# Altium project CM5 Nas.PrjPcb (part 2 of 2)

## Sheet Sata_Drives.SchDoc
size 309 x 209 mm
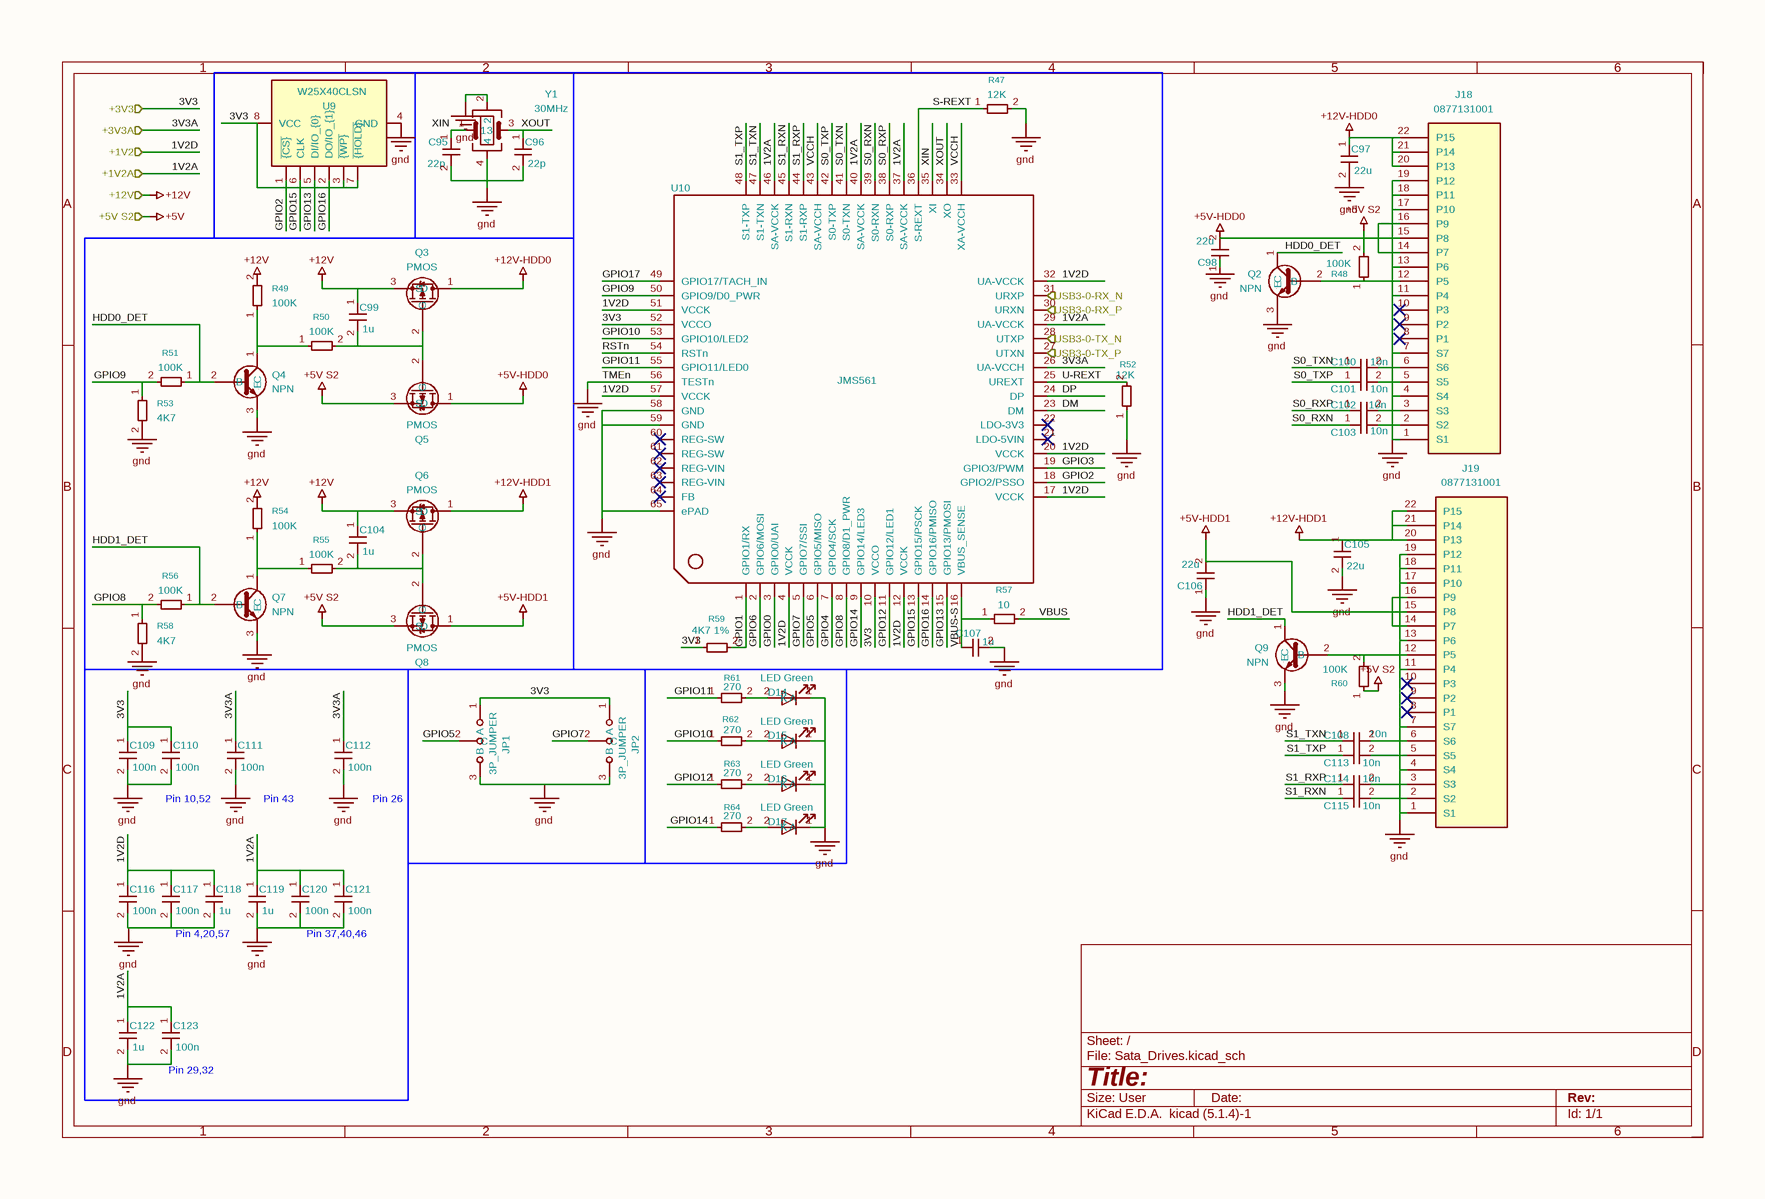
[diagram p11: Sata_Drives.SchDoc]

### Parts
C95  22p  [C_0402_1005Metric]
C96  22p  [C_0402_1005Metric]
C97  22u  [C_1206_3216Metric]
C98  22u  [C_1206_3216Metric]
C99  1u  [C_0805_2012Metric]
C100  10n  [C_0402_1005Metric]
C101  10n  [C_0402_1005Metric]
C102  10n  [C_0402_1005Metric]
C103  10n  [C_0402_1005Metric]
C104  1u  [C_0805_2012Metric]
C105  22u  [C_1206_3216Metric]
C106  22u  [C_1206_3216Metric]
C107  1u  [C_0603_1608Metric]
C108  10n  [C_0402_1005Metric]
C109  100n  [C_0402_1005Metric]
C110  100n  [C_0402_1005Metric]
C111  100n  [C_0402_1005Metric]
C112  100n  [C_0402_1005Metric]
C113  10n  [C_0402_1005Metric]
C114  10n  [C_0402_1005Metric]
C115  10n  [C_0402_1005Metric]
C116  100n  [C_0402_1005Metric]
C117  100n  [C_0402_1005Metric]
C118  1u  [C_0402_1005Metric]
C119  1u  [C_0402_1005Metric]
C120  100n  [C_0402_1005Metric]
C121  100n  [C_0402_1005Metric]
C122  1u  [C_0402_1005Metric]
C123  100n  [C_0402_1005Metric]
D14  LED Green  [LED_0603_1608Metric]
D15  LED Green  [LED_0603_1608Metric]
D16  LED Green  [LED_0603_1608Metric]
D17  LED Green  [LED_0603_1608Metric]
J18  0877131001  [87713-1001]
J19  0877131001  [87713-1001]
JP1  3P_JUMPER  [PinHeader_1x03_P2.54mm_Vertical]
JP2  3P_JUMPER  [PinHeader_1x03_P2.54mm_Vertical]
Q2  NPN  [P200_SOT-23]
Q3  PMOS  [SOT95P237X117-3N]
Q4  NPN  [P200_SOT-23]
Q5  PMOS  [SOT95P237X117-3N]
Q6  PMOS  [SOT95P237X117-3N]
Q7  NPN  [P200_SOT-23]
Q8  PMOS  [SOT95P237X117-3N]
Q9  NPN  [P200_SOT-23]
R47  12K  [R_0603_1608Metric]
R48  100K  [R_0603_1608Metric]
R49  100K  [R_0603_1608Metric]
R50  100K  [R_0603_1608Metric]
R51  100K  [R_0603_1608Metric]
R52  12K  [R_0603_1608Metric]
R53  4K7  [R_0603_1608Metric]
R54  100K  [R_0603_1608Metric]
R55  100K  [R_0603_1608Metric]
R56  100K  [R_0603_1608Metric]
R57  10  [R_0603_1608Metric]
R58  4K7  [R_0603_1608Metric]
R59  4K7 1%  [R_0603_1608Metric]
R60  100K  [R_0603_1608Metric]
R61  270  [R_0603_1608Metric]
R62  270  [R_0603_1608Metric]
R63  270  [R_0603_1608Metric]
R64  270  [R_0603_1608Metric]
U9  W25X40CLSN  [SOIC-8_3.9x4.9mm_P1.27mm]
U10  JMS561  [QFN-64-1EP_8x8mm_P0.4mm_EP6.5x6.5mm_ThermalVias]
Y1  30MHz  [ABM810000MHZ12D2W]

### Ports
+1V2 (in), +1V2A (in), +3V3 (in), +3V3A (in), +5V S2 (in), +12V (in), USB3-0-RX_N (in), USB3-0-RX_P (in), USB3-0-TX_N (out), USB3-0-TX_P (out)

### Nets
1V2D: C116.1 C117.1 C118.1 U10.4(VCCK) U10.12(VCCK) U10.17(VCCK) U10.20(VCCK) U10.32(UA-VCCK) U10.51(VCCK) U10.57(VCCK) ; port +1V2  [project net +1V2]
3V3A: C111.1 C112.1 U10.26(UA-VCCH) ; port +3V3A  [project net +3V3A]
+5V S2: Q5.3(S) Q8.3(S) R48.2 R60.1 ; port +5V S2  [also labelled +5V]
+5V-HDD0: C98.2 J18.14(P7) J18.15(P8) J18.16(P9) Q5.1(D)
+5V-HDD1: C106.2 J19.14(P7) J19.15(P8) J19.16(P9) Q8.1(D)
+12V: C99.1 C104.1 Q3.3(S) Q6.3(S) R49.2 R54.2 ; port +12V
+12V-HDD0: C97.1 J18.20(P13) J18.21(P14) J18.22(P15) Q3.1(D)
+12V-HDD1: C105.1 J19.20(P13) J19.21(P14) J19.22(P15) Q6.1(D)
GND: C95.2 C96.2 C97.2 C98.1 C105.2 C106.1 C107.2 C109.2 C110.2 C111.2 C112.2 C116.2 C117.2 C118.2 C119.2 C120.2 C121.2 C122.2 C123.2 D14.1(K) D15.1(K) D16.1(K) D17.1(K) J18.1(S1) J18.4(S4) J18.7(S7) J18.11(P4) J18.13(P6) J18.17(P10) J18.18(P11) J18.19(P12) J19.1(S1) J19.4(S4) J19.7(S7) J19.11(P4) J19.13(P6) J19.17(P10) J19.18(P11) J19.19(P12) JP1.3(B) JP2.3(B) Q2.3(E) Q4.3(E) Q7.3(E) Q9.3(E) R47.2 R52.1 R53.2 R58.2 U9.4(GND) U10.56(TESTn) U10.58(GND) U10.59(GND) U10.65(ePAD) Y1.2 Y1.4  [also labelled TMEn]
1V2A: C119.1 C120.1 C121.1 C122.1 C123.1 U10.29(UA-VCCK) U10.37(SA-VCCK) U10.40(SA-VCCK) U10.46(SA-VCCK) ; port +1V2A  [project net +1V2A]
3V3: C109.1 C110.1 JP1.1(A) JP2.1(A) R59.1 U9.3(~{{WP}}) U9.7(~{{HOLD}}) U9.8(VCC) U10.10(VCCO) U10.52(VCCO) ; port +3V3  [project net +3V3]
DM: U10.23(DM)
DP: U10.24(DP)
GPIO0: U10.3(GPIO0/UAI)
GPIO1: R59.2 U10.1(GPIO1/RX)
GPIO2: U9.1(~{{CS}}) U10.18(GPIO2/PSSO)
GPIO3: U10.19(GPIO3/PWM)
GPIO4: U10.7(GPIO4/SCK)
GPIO5: JP1.2(C) U10.6(GPIO5/MISO)
GPIO6: U10.2(GPIO6/MOSI)
GPIO7: JP2.2(C) U10.5(GPIO7/SSI)
GPIO8: R56.2 R58.1 U10.8(GPIO8/D1_PWR)
GPIO9: R51.2 R53.1 U10.50(GPIO9/D0_PWR)
GPIO10: R62.1 U10.53(GPIO10/LED2)
GPIO11: R61.1 U10.55(GPIO11/LED0)
GPIO12: R63.1 U10.11(GPIO12/LED1)
GPIO13: U9.5(DI/IO_{0}) U10.15(GPIO13/PMOSI)
GPIO14: R64.1 U10.9(GPIO14/LED3)
GPIO15: U9.6(CLK) U10.13(GPIO15/PSCK)
GPIO16: U9.2(DO/IO_{1}) U10.14(GPIO16/PMISO)
GPIO17: U10.49(GPIO17/TACH_IN)
HDD0_DET: Q2.1(C) Q4.2(B) R51.1
HDD1_DET: Q7.2(B) Q9.1(C) R56.1
RSTn: U10.54(RSTn)
S0_RXN: C103.1 U10.39(S0-RXN)
S0_RXP: C102.1 U10.38(S0-RXP)
S0_TXN: C100.1 U10.41(S0-TXN)
S0_TXP: C101.1 U10.42(S0-TXP)
S1_RXN: C115.1 U10.45(S1-RXN)
S1_RXP: C114.1 U10.44(S1-RXP)
S1_TXN: C108.1 U10.47(S1-TXN)
S1_TXP: C113.1 U10.48(S1-TXP)
S-REXT: R47.1 U10.36(S-REXT)
U-REXT: R52.2 U10.25(UREXT)
USB3-0-RX_N: U10.31(URXP) ; port USB3-0-RX_N
USB3-0-RX_P: U10.30(URXN) ; port USB3-0-RX_P
USB3-0-TX_N: U10.28(UTXP) ; port USB3-0-TX_N
USB3-0-TX_P: U10.27(UTXN) ; port USB3-0-TX_P
VBUS: R57.2
VBUS-S: C107.1 R57.1 U10.16(VBUS_SENSE)
VCCH: U10.33(XA-VCCH) U10.43(SA-VCCH)
XIN: C95.1 U10.35(XI) Y1.1
XOUT: C96.1 U10.34(XO) Y1.3
NetC99_2: C99.2 Q3.2(G) Q5.2(G) R50.2
NetC100_2: C100.2 J18.6(S6)
NetC101_2: C101.2 J18.5(S5)
NetC102_2: C102.2 J18.3(S3)
NetC103_2: C103.2 J18.2(S2)
NetC104_2: C104.2 Q6.2(G) Q8.2(G) R55.2
NetC108_2: C108.2 J19.6(S6)
NetC113_2: C113.2 J19.5(S5)
NetC114_2: C114.2 J19.3(S3)
NetC115_2: C115.2 J19.2(S2)
NetD14_2: D14.2(A) R61.2
NetD15_2: D15.2(A) R62.2
NetD16_2: D16.2(A) R63.2
NetD17_2: D17.2(A) R64.2
NetJ18_12: J18.12(P5) Q2.2(B) R48.1
NetJ19_12: J19.12(P5) Q9.2(B) R60.2
NetQ4_1: Q4.1(C) R49.1 R50.1
NetQ7_1: Q7.1(C) R54.1 R55.1

Not connected (* = marked no-connect by the designer): J18 8(P1)* 9(P2)* 10(P3)*; J19 8(P1)* 9(P2)* 10(P3)*; U10 21(LDO-5VIN)* 22(LDO-3V3)* 60(REG-SW)* 61(REG-SW)* 62(REG-VIN)* 63(REG-VIN)* 64(FB)*

### Notes on the sheet
- Pin 10,52
- Pin 43
- Pin 26
- Pin 4,20,57
- Pin 37,40,46
- (near C123) Pin 29,32
- 1
- 2
- 3
- 4
- 5
- 6
- A
- B
- C
- D
- Title:
- File: Sata_Drives.kicad_sch
- Sheet: /
- KiCad E.D.A.  kicad (5.1.4)-1
- Size: User
- Date:
- Rev:
- Id: 1/1

### Library data of the parts
C95-C123 = C_Small: Description: Unpolarized capacitor, small symbol
  C95 C96: Value: 22p; Footprint: Capacitor_SMD:C_0402_1005Metric
  C97 C98 C105 C106: Value: 22u; Footprint: Capacitor_SMD:C_1206_3216Metric
  C99 C104: Value: 1u; Footprint: Capacitor_SMD:C_0805_2012Metric
  C100-C103 C108 C113-C115: Value: 10n; Footprint: Capacitor_SMD:C_0402_1005Metric
  C107: Value: 1u; Footprint: Capacitor_SMD:C_0603_1608Metric
  C109-C112 C116 C117 C120 C121 C123: Value: 100n; Footprint: Capacitor_SMD:C_0402_1005Metric
  C118 C119 C122: Value: 1u; Footprint: Capacitor_SMD:C_0402_1005Metric
D14-D17 = LED: as D10 on sheet Drives_M.2; Value: LED Green; Footprint: LED_SMD:LED_0603_1608Metric
J18 J19 = 0877131001: Manufacturer_Name: Molex; Description: CONN RCPT 22POS STR .05" SMD AU; Manufacturer_Part_Number: 0877131001; Mouser Part Number: N/A; Mouser Price/Stock: https://www.mouser.co.uk/ProductDetail/Molex/0877131001?qs=PBcRNPEHKspplW%252BmhlTGqA%3D%3D; Arrow Part Number: 0877131001; Arrow Price/Stock: https://www.arrow.com/en/products/0877131001/molex?region=nac; Value: 0877131001; Footprint: 87713-1001:87713-1001
JP1 JP2 = Jumper_3_Bridged12: Description: Jumper, 3-pole, pins 1+2 closed/bridged; Value: 3P_JUMPER; Footprint: Connector_PinHeader_2.54mm:PinHeader_1x03_P2.54mm_Vertical
Q2 Q4 Q7 Q9 = NPN: Description: Bipolar transistor symbol for simulation only, substrate tied to the emitter; Sim.Type: GUMMELPOON; Sim.Pins: 1=C 2=B 3=E; Sim.Device: NPN; Value: NPN; Footprint: MMBT3904:P200_SOT-23
Q3 Q5 Q6 Q8 = PMOS: as Q11 on sheet Sata_Drives2; Sim.Device: PMOS; Value: PMOS; Footprint: AOSS21311C:SOT95P237X117-3N
R47-R64 = R_Small: Description: Resistor, small symbol; Footprint: Resistor_SMD:R_0603_1608Metric
  R47 R52: Value: 12K
  R48-R51 R54-R56 R60: Value: 100K
  R53 R58: Value: 4K7
  R57: Value: 10
  R59: Value: 4K7 1%
  R61-R64: Value: 270
U9 = W25X40CLSN: Description: 4Mbit / 512KiB Serial Flash memory, Standard/Dual I/O SPI, 2.3-3.6V, SOIC-8 (150 mil); Value: W25X40CLSN; Footprint: Package_SO:SOIC-8_3.9x4.9mm_P1.27mm
U10 = JMS561: Description: JMS561 is a SuperSpeed USB 5Gb/s to dual SATA 6Gb/s bridge controller, which also supports various application configurations.; Value: JMS561; Footprint: Package_DFN_QFN:QFN-64-1EP_8x8mm_P0.4mm_EP6.5x6.5mm_ThermalVias
Y1 = Crystal_GND24: Description: Four pin crystal, GND on pins 2 and 4; Value: 30MHz; Footprint: ABM8-30.000MHZ-B2-T:ABM810000MHZ12D2W

## Sheet Section B - TItle B.SchDoc
size 350 x 229 mm
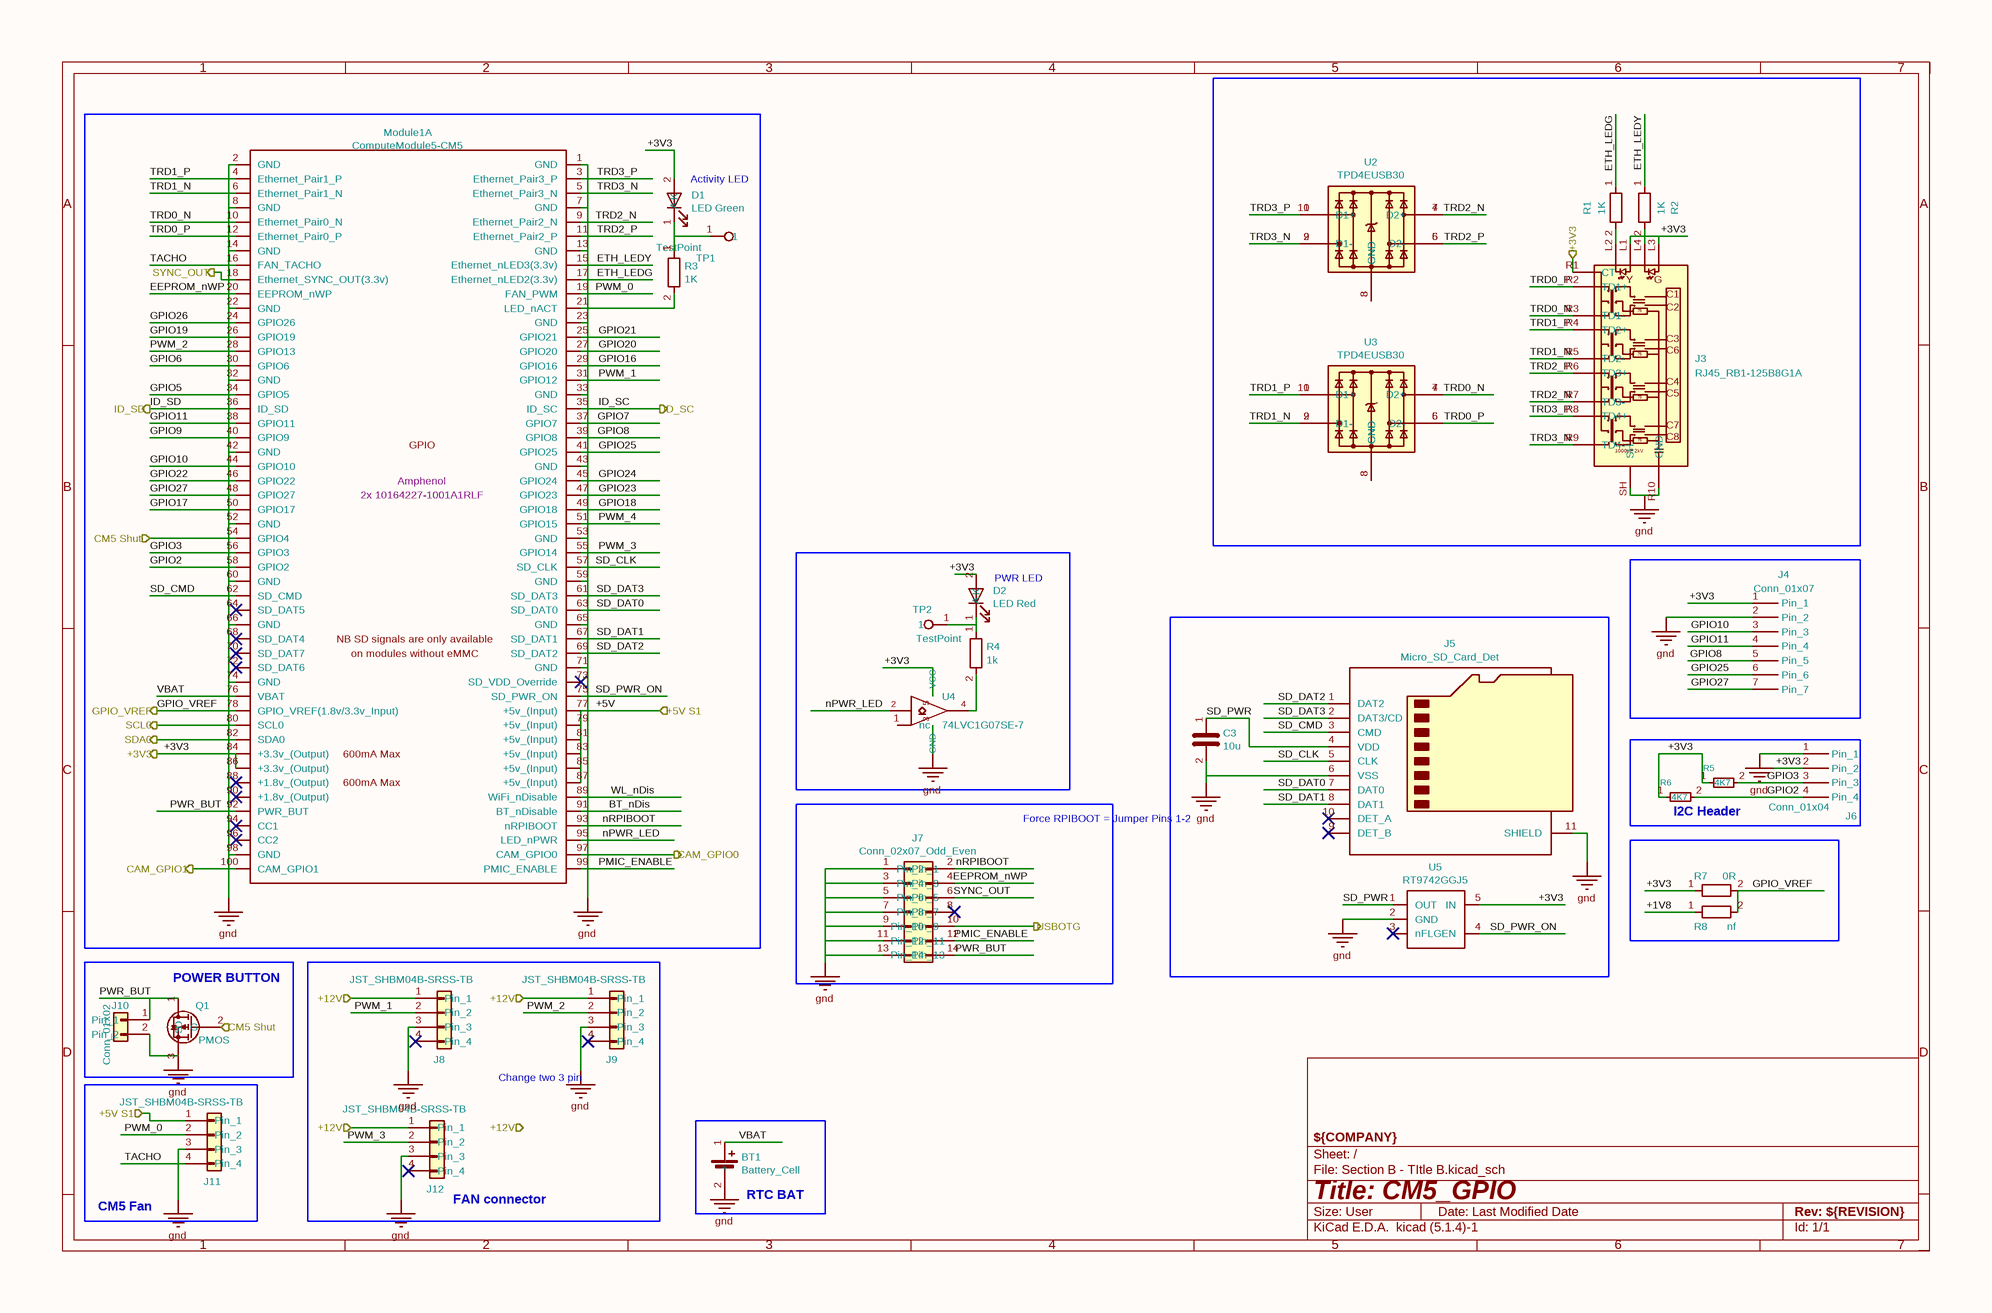
[diagram p12: Section B - TItle B.SchDoc]

### Parts
BT1  Battery_Cell  [BatteryHolder_Keystone_3034_1x20mm]
C3  10u  [C_0805_2012Metric]
D1  LED Green  [LED_0603_1608Metric]
D2  LED Red  [LED_0603_1608Metric]
J3  RJ45_RB1-125B8G1A  [RJ45_UDE_RB1-125B8G1A]
J4  Conn_01x07  [JST_GH_SM07B-GHS-TB_1x07-1MP_P1.25mm_Horizontal]
J5  Micro_SD_Card_Det  [DM3ATSFPEJM5]
J6  Conn_01x04  [SPARKFUN_PRT-14417]
J7  Conn_02x07_Odd_Even  [PinHeader_2x07_P2.54mm_Vertical]
J8  JST_SHBM04B-SRSS-TB  [JST_SH_BM04B-SRSS-TB_1x04-1MP_P1.00mm_Vertical]
J9  JST_SHBM04B-SRSS-TB  [JST_SH_BM04B-SRSS-TB_1x04-1MP_P1.00mm_Vertical]
J10  Conn_01x02  [JST_GH_BM02B-GHS-TBT_1x02-1MP_P1.25mm_Vertical]
J11  JST_SHBM04B-SRSS-TB  [JST_SH_BM04B-SRSS-TB_1x04-1MP_P1.00mm_Vertical]
J12  JST_SHBM04B-SRSS-TB  [JST_SH_BM04B-SRSS-TB_1x04-1MP_P1.00mm_Vertical]
Module1  Field4: Amphenol  Field5: 2x 10164227-1001A1RLF  [Raspberry-Pi-5-Compute-Module]  (hidden comment: ComputeModule5-CM5)  (part A of 2)
Q1  PMOS  [BSS84AKW115]
R1  1K  [R_0603_1608Metric]
R2  1K  [R_0603_1608Metric]
R3  1K  [R_0603_1608Metric]
R4  1k  [R_0603_1608Metric]
R5  4K7  [R_0603_1608Metric]
R6  4K7  [R_0603_1608Metric]
R7  0R  [R_0805_2012Metric_Pad1.20x1.40mm_HandSolder]
R8  nf  [R_0805_2012Metric_Pad1.20x1.40mm_HandSolder]
TP1  TestPoint  [TestPoint_Pad_1.0x1.0mm]
TP2  TestPoint  [TestPoint_Pad_1.0x1.0mm]
U2  TPD4EUSB30  [USON-10_2.5x1.0mm_P0.5mm]
U3  TPD4EUSB30  [USON-10_2.5x1.0mm_P0.5mm]
U4  74LVC1G07SE-7  [SOT-353_SC-70-5]
U5  RT9742GGJ5  [SOT-23-5]

### Blocks framed on the sheet
Activity LED: D1 Module1 R3 TP1
PWR LED: D2 R4 TP2 U4
I2C Header /: J6 R5 R6
Force RPIBOOT = Jumper Pins 1-2 /: J7
POWER BUTTON: J10 Q1
FAN connector /: J8 J9 J12
CM5 Fan /: J11
RTC BAT: BT1

### Ports
+3V3 (in), +3V3 (out), +5V S1 (in), +12V (in), CAM_GPIO0 (out), CAM_GPIO1 (out), CM5 Shut (in), GPIO_VREF (out), ID_SC (out), ID_SD (out), SCL0 (out), SDA0 (out), SYNC_OUT (out), USBOTG (out)

### Nets
+12V: J8.1(Pin_1) J9.1(Pin_1) J12.1(Pin_1) ; port +12V
GND: BT1.2(-) C3.2 J3.R10(GND) J3.SH J4.2(Pin_2) J5.6(VSS) J5.11(SHIELD) J6.1(Pin_1) J7.1(Pin_1) J7.3(Pin_3) J7.5(Pin_5) J7.7(Pin_7) J7.9(Pin_9) J7.11(Pin_11) J7.13(Pin_13) J8.3(Pin_3) J9.3(Pin_3) J10.2(Pin_2) J11.3(Pin_3) J12.3(Pin_3) Module1.1(GND) Module1.2(GND) Module1.7(GND) Module1.8(GND) Module1.13(GND) Module1.14(GND) Module1.22(GND) Module1.23(GND) Module1.32(GND) Module1.33(GND) Module1.42(GND) Module1.43(GND) Module1.52(GND) Module1.53(GND) Module1.59(GND) Module1.60(GND) Module1.65(GND) Module1.66(GND) Module1.71(GND) Module1.74(GND) Module1.98(GND) Q1.3(S) U4.3(GND) U5.2(GND)
+1V8: R8.1
+3V3: D1.2(A) D2.2(A) J3.L1 J3.L3 J3.R1(CT) J4.1(Pin_1) J6.2(Pin_2) Module1.84(+3.3v_(Output)) Module1.86(+3.3v_(Output)) R5.1 R6.1 R7.1 U4.5(VCC) U5.5(IN) ; port +3V3
+5V: J11.1(Pin_1) Module1.77(+5v_(Input)) Module1.79(+5v_(Input)) Module1.81(+5v_(Input)) Module1.83(+5v_(Input)) Module1.85(+5v_(Input)) Module1.87(+5v_(Input)) ; port +5V S1
BT_nDis: Module1.91(BT_nDisable)
CAM_GPIO0: Module1.97(CAM_GPIO0) ; port CAM_GPIO0
CAM_GPIO1: Module1.100(CAM_GPIO1) ; port CAM_GPIO1
CM5 Shut: Module1.54(GPIO4) Q1.2(G) ; port CM5 Shut
EEPROM_nWP: J7.4(Pin_4) Module1.20(EEPROM_nWP)
ETH_LEDG: Module1.17(Ethernet_nLED2(3.3v)) R1.1
ETH_LEDY: Module1.15(Ethernet_nLED3(3.3v)) R2.1
GPIO2: J6.4(Pin_4) Module1.58(GPIO2) R6.2
GPIO3: J6.3(Pin_3) Module1.56(GPIO3) R5.2
GPIO5: Module1.34(GPIO5)
GPIO6: Module1.30(GPIO6)
GPIO7: Module1.37(GPIO7)
GPIO8: J4.5(Pin_5) Module1.39(GPIO8)
GPIO9: Module1.40(GPIO9)
GPIO10: J4.3(Pin_3) Module1.44(GPIO10)
GPIO11: J4.4(Pin_4) Module1.38(GPIO11)
GPIO16: Module1.29(GPIO16)
GPIO17: Module1.50(GPIO17)
GPIO18: Module1.49(GPIO18)
GPIO19: Module1.26(GPIO19)
GPIO20: Module1.27(GPIO20)
GPIO21: Module1.25(GPIO21)
GPIO22: Module1.46(GPIO22)
GPIO23: Module1.47(GPIO23)
GPIO24: Module1.45(GPIO24)
GPIO25: J4.6(Pin_6) Module1.41(GPIO25)
GPIO26: Module1.24(GPIO26)
GPIO27: J4.7(Pin_7) Module1.48(GPIO27)
GPIO_VREF: Module1.78(GPIO_VREF(1.8v/3.3v_Input)) R7.2 R8.2 ; port GPIO_VREF
ID_SC: Module1.35(ID_SC) ; port ID_SC
ID_SD: Module1.36(ID_SD) ; port ID_SD
nPWR_LED: Module1.95(LED_nPWR) U4.2
nRPIBOOT: J7.2(Pin_2) Module1.93(nRPIBOOT)
PMIC_ENABLE: J7.12(Pin_12) Module1.99(PMIC_ENABLE)
PWM_0: J11.2(Pin_2) Module1.19(FAN_PWM)
PWM_1: J8.2(Pin_2) Module1.31(GPIO12)
PWM_2: J9.2(Pin_2) Module1.28(GPIO13)
PWM_3: J12.2(Pin_2) Module1.55(GPIO14)
PWM_4: Module1.51(GPIO15)
PWR_BUT: J7.14(Pin_14) J10.1(Pin_1) Module1.92(PWR_BUT) Q1.1(D)
SCL0: Module1.80(SCL0) ; port SCL0
SD_CLK: J5.5(CLK) Module1.57(SD_CLK)
SD_CMD: J5.3(CMD) Module1.62(SD_CMD)
SD_DAT0: J5.7(DAT0) Module1.63(SD_DAT0)
SD_DAT1: J5.8(DAT1) Module1.67(SD_DAT1)
SD_DAT2: J5.1(DAT2) Module1.69(SD_DAT2)
SD_DAT3: J5.2(DAT3/CD) Module1.61(SD_DAT3)
SD_PWR: C3.1 J5.4(VDD) U5.1(OUT)
SD_PWR_ON: Module1.75(SD_PWR_ON) U5.4(EN)
SDA0: Module1.82(SDA0) ; port SDA0
SYNC_OUT: J7.6(Pin_6)
SYNC_OUT: Module1.18(Ethernet_SYNC_OUT(3.3v)) ; port SYNC_OUT  [a separate net that carries the same name]
TACHO: J11.4(Pin_4) Module1.16(FAN_TACHO)
TRD0_N: J3.R3(TD1-) Module1.10(Ethernet_Pair0_N) U3.4(D2+) U3.7
TRD0_P: J3.R2(TD1+) Module1.12(Ethernet_Pair0_P) U3.5(D2-) U3.6
TRD1_N: J3.R5(TD2-) Module1.6(Ethernet_Pair1_N) U3.2(D1-) U3.9
TRD1_P: J3.R4(TD2+) Module1.4(Ethernet_Pair1_P) U3.1(D1+) U3.10
TRD2_N: J3.R7(TD3-) Module1.9(Ethernet_Pair2_N) U2.4(D2+) U2.7
TRD2_P: J3.R6(TD3+) Module1.11(Ethernet_Pair2_P) U2.5(D2-) U2.6
TRD3_N: J3.R9(TD4-) Module1.5(Ethernet_Pair3_N) U2.2(D1-) U2.9
TRD3_P: J3.R8(TD4+) Module1.3(Ethernet_Pair3_P) U2.1(D1+) U2.10
USBOTG: J7.10(Pin_10) ; port USBOTG
VBAT: BT1.1(+) Module1.76(VBAT)
WL_nDis: Module1.89(WiFi_nDisable)
NetD1_1: D1.1(K) R3.1 TP1.1
NetD2_1: D2.1(K) R4.1 TP2.1
NetJ3_L2: J3.L2 R1.2
NetJ3_L4: J3.L4 R2.2
NetModule1_21: Module1.21(LED_nACT) R3.2
NetR4_2: R4.2 U4.4
NetU2_3: U2.3(GND) U2.8(GND)
NetU3_3: U3.3(GND) U3.8(GND)

Not connected (* = marked no-connect by the designer): J5 9(DET_B)* 10(DET_A)*; J7 8(Pin_8)*; J8 4(Pin_4)*; J9 4(Pin_4)*; J12 4(Pin_4)*; Module1 64(SD_DAT5)* 68(SD_DAT4)* 70(SD_DAT7)* 72(SD_DAT6)* 73(SD_VDD_Override)* 88(+1.8v_(Output))* 90(+1.8v_(Output))* 94(CC1)* 96(CC2)*; U4 1(nc); U5 3(nFLG)*

### Notes on the sheet
- (near J9) Change two 3 pin
- 1
- 2
- 3
- 4
- 5
- 6
- 7
- A
- B
- C
- D
- Title: CM5_GPIO
- File: Section B - TItle B.kicad_sch
- Sheet: /
- ${COMPANY}
- KiCad E.D.A.  kicad (5.1.4)-1
- Size: User
- Date: Last Modified Date
- Rev: ${REVISION}
- Id: 1/1
- (in symbol ComputeModule5-CM5, part A) GPIO; NB SD signals are only available; on modules without eMMC; 600mA Max
- (in symbol RJ45_RB1-125B8G1A) Y; G; C1; 75; C2; C3; C6; C4; C5; C7; C8; 1000pF 2kV

### Library data of the parts
BT1 = Battery_Cell: Part Description: Battery Retainer Coin, 20.0mm 1 Cell SMD (SMT) Tab; Field4: Digikey; Field5: 36-3034-ND; Field6: 3034; Field7: Keystone; Value: Battery_Cell; Footprint: Battery:BatteryHolder_Keystone_3034_1x20mm
C3 = C: Part Description: 10uF 10% 10V Ceramic Capacitor X7R 0805 (2012 Metric); Field5: 490-14381-1-ND; Field4: Digikey; Field6: GRM21BR71A106KA73L; Field7: Murata; Field8: 111893011; Value: 10u; Footprint: Capacitor_SMD:C_0805_2012Metric
D1 = LED: Part Description: Green 572nm LED Indication - Discrete 2.2V 2-SMD, No Lead; Field4: Digikey; Field5: LTST-S270KGKT; Field6: SML-A12M8TT86N; Field7: Rohm; Field8: 650263301; Value: LED Green; Footprint: LED_SMD:LED_0603_1608Metric
D2 = LED_1: Part Description: Red 620nm LED Indication - Discrete 2.2V 2-SMD, No Lead; Field4: Digikey; Field5: LTST-S270KRKT; Field6: SML-A12U8TT86Q; Field7: Rohm; Field8: 650295101; Value: LED Red; Footprint: LED_SMD:LED_0603_1608Metric
J3 = RJ45_RB1-125B8G1A: Description: LAN Transformer Jack, RJ45, 10/100/1000 BaseT; Value: RJ45_RB1-125B8G1A; Footprint: Connector_RJ:RJ45_UDE_RB1-125B8G1A
J4 = Conn_01x07_Socket: Description: Generic connector, single row, 01x07, script generated; Value: Conn_01x07; Footprint: Connector_JST:JST_GH_SM07B-GHS-TB_1x07-1MP_P1.25mm_Horizontal
J5 = Micro_SD_Card_Det2: Part Description: 9 (8 + 1) Position Card Connector microSD™ Surface Mount, Right Angle Gold; Field4: Farnell; Field5: 2358234; Field6: 503398-1892; Field7: Molex; Field8: UCON00512; Value: Micro_SD_Card_Det; Footprint: DM3AT-SF-PEJM5:DM3ATSFPEJM5
J6 = Conn_01x04_Socket: Description: Generic connector, single row, 01x04, script generated; Value: Conn_01x04; Footprint: PRT-14417:SPARKFUN_PRT-14417
J7 = Conn_02x07_Odd_Even: Field4: Toby; Field5: THD-07-R; Field6: THD-07-R; Field7: Toby; Part Description: PinHeader_2x07_P2.54mm_Vertical; Value: Conn_02x07_Odd_Even; Footprint: Connector_PinHeader_2.54mm:PinHeader_2x07_P2.54mm_Vertical
J8 J9 J11 J12 = Conn_01x04: Part Description: 4 pin vertical 1mm pitch connector; Field7: JST; Field5: SHBM04B-SRSS-TB; Field6: SHBM04B-SRSS-TB; Value: JST_SHBM04B-SRSS-TB; Footprint: Connector_JST:JST_SH_BM04B-SRSS-TB_1x04-1MP_P1.00mm_Vertical
J10 = Conn_01x02: Description: Generic connector, single row, 01x02, script generated (kicad-library-utils/schlib/autogen/connector/); Value: Conn_01x02; Footprint: Connector_JST:JST_GH_BM02B-GHS-TBT_1x02-1MP_P1.25mm_Vertical
Module1 = ComputeModule5-CM5: Part Description: 100 Position Connector Receptacle, Center Strip Contacts Surface Mount Gold; Description: RaspberryPi Compute module 5; Field7: Hirose; Field6: 2x 10164227-1001A1RLF; Value: ComputeModule5-CM5; Footprint: cm5:Raspberry-Pi-5-Compute-Module
Q1 = PMOS: Description: P-MOSFET transistor, drain/source/gate; Sim.Type: VDMOS; Sim.Pins: 1=D 2=G 3=S; Sim.Device: PMOS; Value: PMOS; Footprint: BSS84AKW115:BSS84AKW115
R1 R2 = R: Part Description: Resistor 470R M1005 1% 63mW; Field4: Farnell; Field5: 9239197; Field7: KOA EUROPE GMBH; Field6: RK73G1ETQTP4700D; Field8: 120887981; Value: 1K; Footprint: Resistor_SMD:R_0603_1608Metric
R3 R4 = R: Part Description: Resistor 1K M1005 1% 63mW; Field4: Farnell; Field5: 9239235; Field7: KOA EUROPE GMBH; Field6: RK73H1ETTP1001F; Field8: 125049511; Footprint: Resistor_SMD:R_0603_1608Metric
  R3: Value: 1K
  R4: Value: 1k
R5 R6 = R_Small: Description: Resistor, small symbol; Value: 4K7; Footprint: Resistor_SMD:R_0603_1608Metric
R7 = R: Part Description: Resistor 0R M2012 5%; Field4: Farnell; Field5: 9233750; Field7: Rohm; Field6: MCR10EZPJ000; Field8: 121629591; Value: 0R; Footprint: Resistor_SMD:R_0805_2012Metric_Pad1.20x1.40mm_HandSolder
R8 = R: Field4: nf; Field5: nf; Field6: nf; Value: nf; Footprint: Resistor_SMD:R_0805_2012Metric_Pad1.20x1.40mm_HandSolder
TP1 TP2 = TestPoint: Field4: nf; Field5: nf; Field6: nf; Field7: nf; Part Description: Test point; Value: TestPoint; Footprint: TestPoint:TestPoint_Pad_1.0x1.0mm
U2 U3 = TPD4EUSB30: Part Description: Quad TVS diode for high speed signals (USB3, GigE etc.); Field4: Farnell; Field5: 2335455; Field6: CDDFN10-3324P-13; Field7: Bourns; Field8: UDIO00346; Value: TPD4EUSB30; Footprint: Package_SON:USON-10_2.5x1.0mm_P0.5mm
U4 = 74LVC1G07_copy: Part Description: Buffer, Non-Inverting 1 Element 1 Bit per Element Open Drain Output SOT-353; Field4: Farnell; Field5: 2425492; Field7: Diodes; Field6: 74LVC1G07SE-7; Value: 74LVC1G07SE-7; Footprint: Package_TO_SOT_SMD:SOT-353_SC-70-5
U5 = RT9742GGJ5: Part Description: Power Switch/Driver 1:1 N-Channel 1A TSOT-23-5; Field4: Farnell; Field5: 2545875; Field7: RichTek; Field8: USWI00166; Field6: RT9742GGJ5; Value: RT9742GGJ5; Footprint: Package_TO_SOT_SMD:SOT-23-5

## Sheet untitled.SchDoc
size 209 x 148 mm
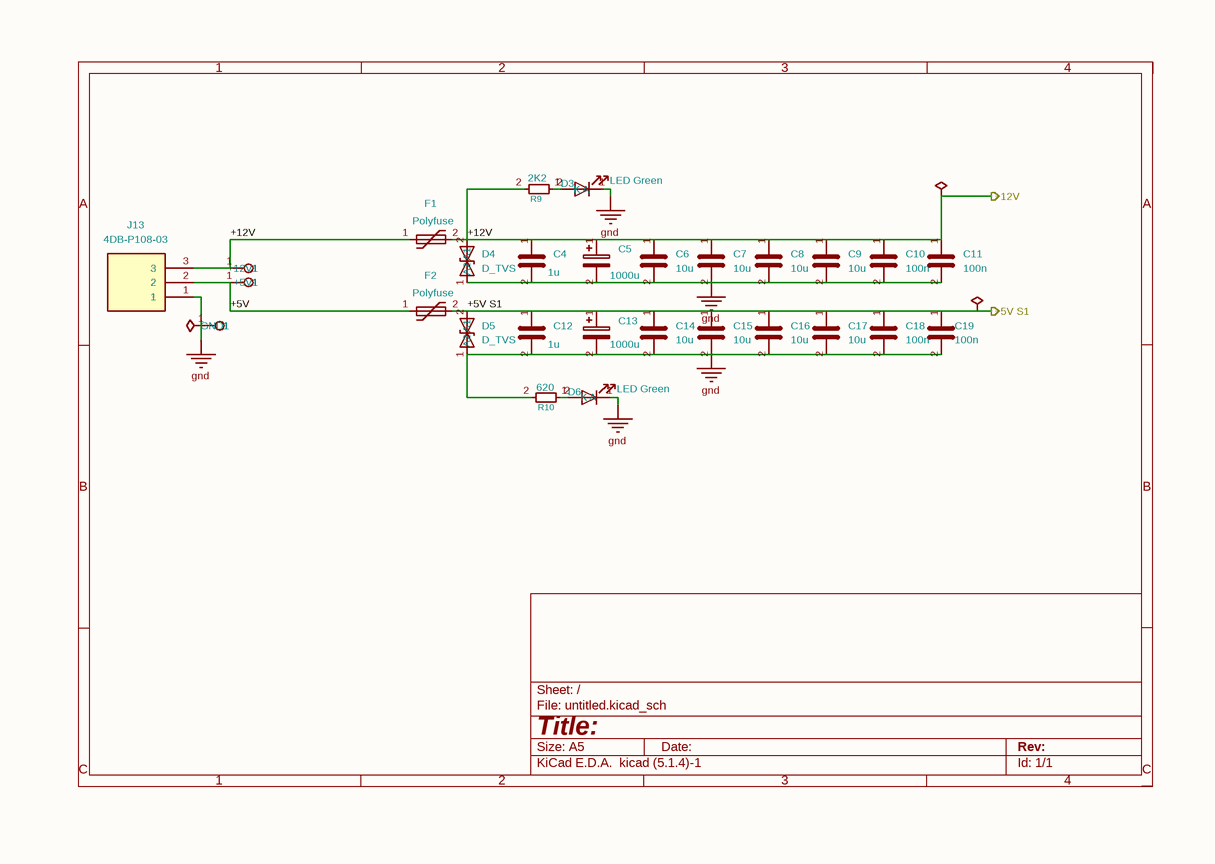
[diagram p13: untitled.SchDoc]

### Parts
#FLG01  PWR_FLAG  (value not drawn)  (graphical)
#FLG02  PWR_FLAG  (value not drawn)  (graphical)
#FLG03  PWR_FLAG  (value not drawn)  (graphical)
+5V1  TestPoint  [TestPoint_Pad_1.0x1.0mm]  (value not drawn)
+12V1  TestPoint  [TestPoint_Pad_1.0x1.0mm]  (value not drawn)
C4  1u  [C_1210_3225Metric]
C5  1000u  [EEE0JA152UAP]
C6  10u  [C_1210_3225Metric]
C7  10u  [C_1210_3225Metric]
C8  10u  [C_1210_3225Metric]
C9  10u  [C_1210_3225Metric]
C10  100n  [C_0402_1005Metric]
C11  100n  [C_0402_1005Metric]
C12  1u  [C_1210_3225Metric]
C13  1000u  [EEE0JA152UAP]
C14  10u  [C_1210_3225Metric]
C15  10u  [C_1210_3225Metric]
C16  10u  [C_1210_3225Metric]
C17  10u  [C_1210_3225Metric]
C18  100n  [C_0402_1005Metric]
C19  100n  [C_0402_1005Metric]
D3  LED Green  [LED_0603_1608Metric]
D4  D_TVS  [SMBJ12A]
D5  D_TVS  [SMBJ5.0A]
D6  LED Green  [LED_0603_1608Metric]
F1  Polyfuse  [RGEF1200]
F2  Polyfuse  [RGEF1200]
GND1  TestPoint  [TestPoint_Pad_1.0x1.0mm]  (value not drawn)
J13  4DB-P108-03  [4DBP10803]
R9  2K2  [R_0603_1608Metric]
R10  620  [R_0603_1608Metric]

### Ports
+5V S1 (out), +12V (out)

### Nets
+12V: #FLG01.1 +12V1.1 C4.1 C5.1 C6.1 C7.1 C8.1 C9.1 C10.1 C11.1 D4.2(A2) F1.1 F1.2 J13.3 R9.2 ; port +12V
GND: #FLG03.1 C4.2 C5.2 C6.2 C7.2 C8.2 C9.2 C10.2 C11.2 C12.2 C13.2 C14.2 C15.2 C16.2 C17.2 C18.2 C19.2 D3.1(K) D4.1(A1) D5.1(A1) D6.1(K) GND1.1 J13.1 R10.2
+5V: +5V1.1 F2.1 J13.2
+5V S1: #FLG02.1 C12.1 C13.1 C14.1 C15.1 C16.1 C17.1 C18.1 C19.1 D5.2(A2) F2.2 ; port +5V S1  [project net +5V]
NetD3_2: D3.2(A) R9.1
NetD6_2: D6.2(A) R10.1

### Notes on the sheet
- 1
- 2
- 3
- 4
- A
- B
- Title:
- File: untitled.kicad_sch
- Sheet: /
- C
- KiCad E.D.A.  kicad (5.1.4)-1
- Size: A5
- Date:
- Rev:
- Id: 1/1

### Library data of the parts
#FLG01 #FLG02 #FLG03 = PWR_FLAG: Description: Special symbol for telling ERC where power comes from; Value: PWR_FLAG
C4 C6-C12 C14-C19 = C: Description: Unpolarized capacitor
  C4 C12: Value: 1u; Footprint: Capacitor_SMD:C_1210_3225Metric
  C6-C9 C14-C17: Value: 10u; Footprint: Capacitor_SMD:C_1210_3225Metric
  C10 C11 C18 C19: Value: 100n; Footprint: Capacitor_SMD:C_0402_1005Metric
C5 C13 = C_Polarized: Description: Polarized capacitor; Value: 1000u; Footprint: EEE0JA152UAP:EEE0JA152UAP
D3 D6 = LED: as D1 on sheet Section B - TItle B; Value: LED Green; Footprint: LED_SMD:LED_0603_1608Metric
D4 D5 = D_TVS: Description: Bidirectional transient-voltage-suppression diode; Value: D_TVS
  D4: Footprint: SMBJ12A:SMBJ12A
  D5: Footprint: SMBJ5.0A:SMBJ5.0A
F1 F2 = Polyfuse: Description: Resettable fuse, polymeric positive temperature coefficient; Value: Polyfuse; Footprint: RGEF1200:RGEF1200
J13 = 4DB-P108-03: Manufacturer_Name: TE Connectivity; Description: Dual Barrier, Printed Circuit Pin, Wire-to-Board, 3 Position, 8.26 mm [.325 in] Centerline, 1 Row, Buchanan 4DB Series, Barrier Strips; Height: 13.589; Manufacturer_Part_Number: 4DB-P108-03; Mouser Part Number: 571-214376675; Mouser Price/Stock: https://www.mouser.co.uk/ProductDetail/TE-Connectivity/4DB-P108-03?qs=cX92MwKKzGt2YIn2dZcfJQ%3D%3D; Arrow Part Number: 4DB-P108-03; Arrow Price/Stock: https://www.arrow.com/en/products/4db-p108-03/te-connectivity?utm_currency=USD&region=nac; Value: 4DB-P108-03; Footprint: 4DB-P108-03:4DBP10803
R9 R10 = R_Small: Description: Resistor, small symbol; Footprint: Resistor_SMD:R_0603_1608Metric
  R9: Value: 2K2
  R10: Value: 620
+5V1 +12V1 GND1 = TestPoint: Description: test point; Value: TestPoint; Footprint: TestPoint:TestPoint_Pad_1.0x1.0mm

## Nets that join several sheets
+1V2: Drives_M.2 (24 pins), Sata_Drives2 (10 pins), Power (7 pins), Sata_Drives (10 pins)
+3V3A: Drives_M.2 (17 pins), Sata_Drives2 (C139.1 C140.1 U12.26 U12.43), Power (7 pins), USB & Ethernet (IC4.5 IC4.10 IC4.29 IC4.36), Sata_Drives (C111.1 C112.1 U10.26)
+5V S2: Sata_Drives2 (Q13.3 Q16.3 R66.2 R78.2), Power (7 pins), Sata_Drives (Q5.3 Q8.3 R48.2 R60.1)
+12V: Sata_Drives2 (6 pins), Power (8 pins), Sata_Drives (6 pins), Section B - TItle B (J8.1 J9.1 J12.1), untitled (15 pins)
GND: Drives_M.2 (123 pins), Sata_Drives2 (56 pins), Power (53 pins), USB & Ethernet (14 pins), Section A - Title A (46 pins), Sata_Drives (56 pins), Section B - TItle B (44 pins), untitled (24 pins)
+1V2A: Sata_Drives2 (9 pins), Power (6 pins), Sata_Drives (9 pins)
+3V3: Sata_Drives2 (10 pins), Power (5 pins), USB & Ethernet (IC4.15 IC4.23 IC4.26 R83.1), Section A - Title A (J2.22), Sata_Drives (10 pins), Section B - TItle B (14 pins)
+5V: Drives_M.2 (7 pins), Power (15 pins), USB & Ethernet (J22.1 J22.5), Section A - Title A (C1.1 U1.1), Section B - TItle B (7 pins), untitled (11 pins)
CAM_GPIO0: Section A - Title A (J2.17), Section B - TItle B (Module1.97)
CAM_GPIO1: Section A - Title A (J2.18), Section B - TItle B (Module1.100)
PCIE_CLK_N: Drives_M.2 (U8.47), Section A - Title A (Module1.112)
PCIE_CLK_P: Drives_M.2 (U8.46), Section A - Title A (Module1.110)
PCIE_nCLKREQ: Drives_M.2 (J14.52 J15.52 J16.52 J17.52), Section A - Title A (Module1.102)
PCIE_nRST: Drives_M.2 (U8.3), Section A - Title A (Module1.109)
PCIE_nWAKE: Drives_M.2 (J14.54 J15.54 J16.54 J17.54), Section A - Title A (Module1.104)
PCIE_RX_N: Drives_M.2 (U8.52), Section A - Title A (Module1.118)
PCIE_RX_P: Drives_M.2 (U8.51), Section A - Title A (Module1.116)
PCIE_TX_N: Drives_M.2 (C89.1), Section A - Title A (Module1.124)
PCIE_TX_P: Drives_M.2 (C88.1), Section A - Title A (Module1.122)
SCL0: Section A - Title A (J2.20), Section B - TItle B (Module1.80)
SDA0: Section A - Title A (J2.21), Section B - TItle B (Module1.82)
USB2_N: USB & Ethernet (IC4.30), Section A - Title A (Module1.103)
USB2_P: USB & Ethernet (IC4.31), Section A - Title A (Module1.105)
USB3-0-RX_N: Section A - Title A (Module1.128), Sata_Drives (U10.31)
USB3-0-RX_P: Section A - Title A (Module1.130), Sata_Drives (U10.30)
USB3-0-TX_N: Section A - Title A (Module1.140), Sata_Drives (U10.28)
USB3-0-TX_P: Section A - Title A (Module1.142), Sata_Drives (U10.27)
USB3-1-RX_N: Sata_Drives2 (U12.31), Section A - Title A (Module1.157)
USB3-1-RX_P: Sata_Drives2 (U12.30), Section A - Title A (Module1.159)
USB3-1-TX_N: Sata_Drives2 (U12.28), Section A - Title A (Module1.169)
USB3-1-TX_P: Sata_Drives2 (U12.27), Section A - Title A (Module1.171)
USBOTG: Section A - Title A (Module1.101), Section B - TItle B (J7.10)